# Altium schematic sheet TEAM12_SCHEMATIC.SchDoc
size A3; SheetNumber: 2; SheetTotal: 2
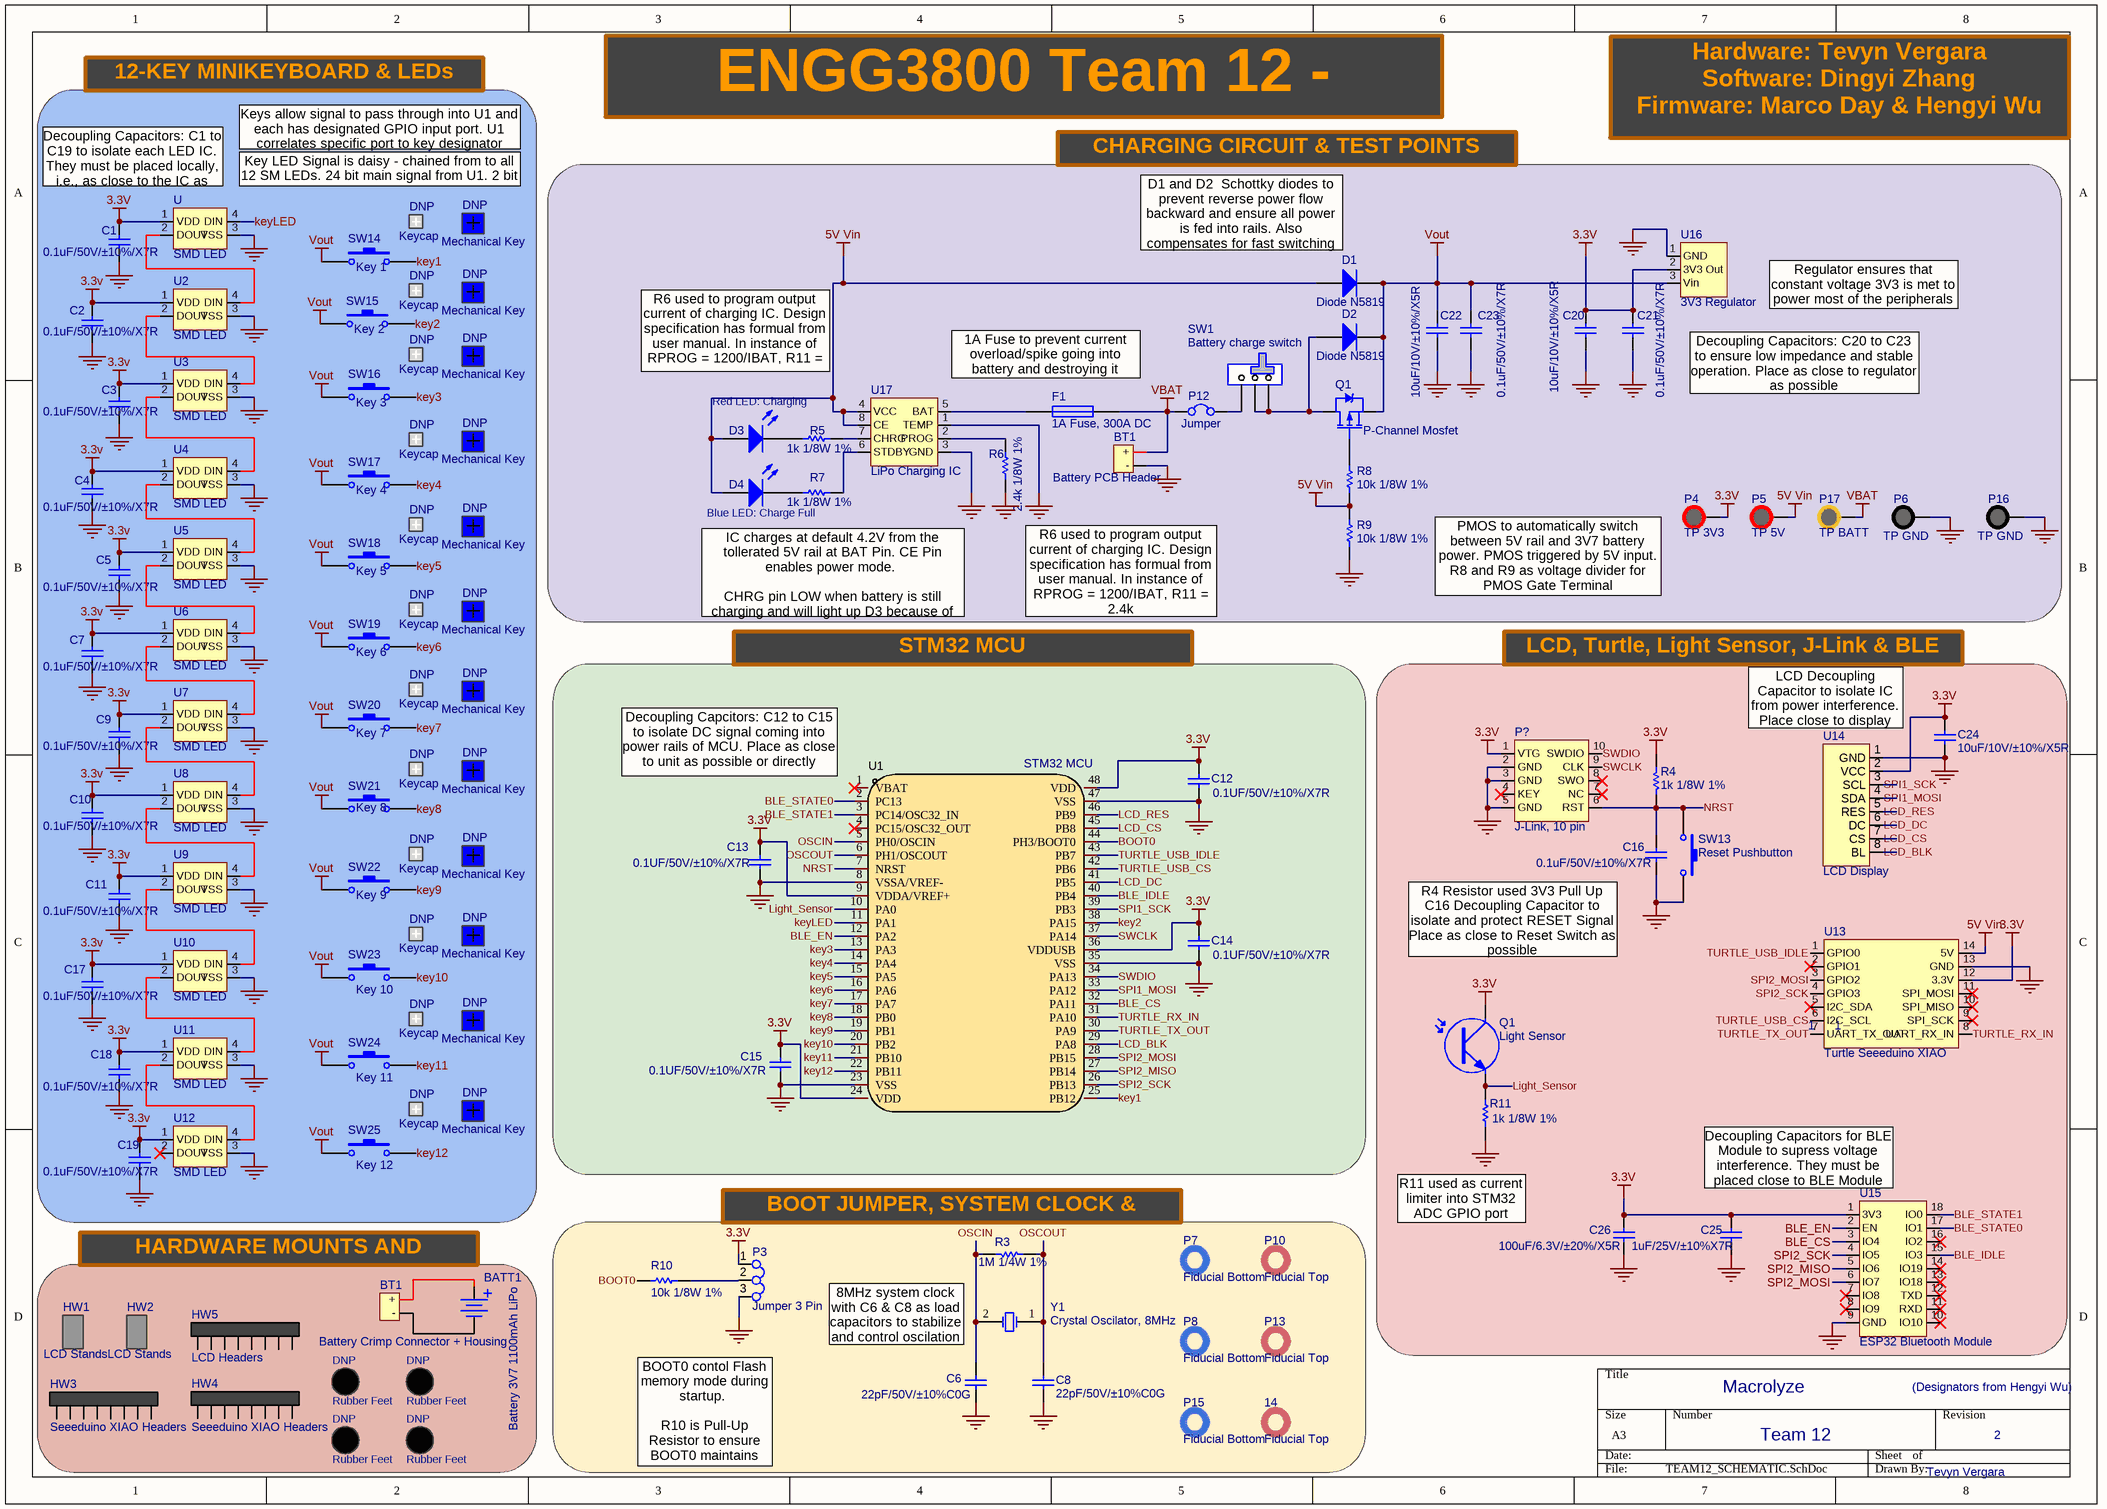
[diagram p0: TEAM12_SCHEMATIC.SchDoc]

## Parts
(Parts that share a designator on the sheet are numbered #1, #2 ... from top to bottom, then left to right.)
14  Fiducial Top
BATT1  Battery 3V7 1100mAh LiPo  [BAT-2]
BT1#1  Battery PCB Header
BT1#2  Battery Crimp Connector + Housing
C1  value 0.1uF/50V/±10%/X7R  [0805]
C2  value 0.1uF/50V/±10%/X7R  [0805]
C3  value 0.1uF/50V/±10%/X7R  [0805]
C4  value 0.1uF/50V/±10%/X7R  [0805]
C5  value 0.1uF/50V/±10%/X7R  [0805]
C6  value 22pF/50V/±10%C0G  [0805]
C7  value 0.1uF/50V/±10%/X7R  [0805]
C8  value 22pF/50V/±10%C0G  [0805]
C9  value 0.1uF/50V/±10%/X7R  [0805]
C10  value 0.1uF/50V/±10%/X7R  [0805]
C11  value 0.1uF/50V/±10%/X7R  [0805]
C12  value 0.1UF/50V/±10%/X7R  [1206C]
C13  value 0.1UF/50V/±10%/X7R  [1206C]
C14  value 0.1UF/50V/±10%/X7R  [1206C]
C15  value 0.1UF/50V/±10%/X7R  [1206C]
C16  value 0.1uF/50V/±10%/X7R  [1206C]
C17  value 0.1uF/50V/±10%/X7R  [0805]
C18  value 0.1uF/50V/±10%/X7R  [0805]
C19  value 0.1uF/50V/±10%/X7R  [0805]
C20  value 10uF/10V/±10%/X5R  [1206C]
C21  value 0.1uF/50V/±10%/X7R  [1206C]
C22  value 10uF/10V/±10%/X5R  [1206C]
C23  value 0.1uF/50V/±10%/X7R  [1206C]
C24  value 10uF/10V/±10%/X5R  [1206C]
C25  value 1uF/25V/±10%X7R  [0805]
C26  value 100uF/6.3V/±20%/X5R  [1206C]
D1  Diode N5819  [DO-41]
D2  Diode N5819  [DO-41]
D3  Red LED: Charging  [0805LED]
D4  Blue LED: Charge Full  [0805LED]
DNP#1  Keycap
DNP#2  Mechanical Key
DNP#3  Keycap
DNP#4  Mechanical Key
DNP#5  Keycap
DNP#6  Mechanical Key
DNP#7  Keycap
DNP#8  Mechanical Key
DNP#9  Keycap
DNP#10  Mechanical Key
DNP#11  Keycap
DNP#12  Mechanical Key
DNP#13  Keycap
DNP#14  Mechanical Key
DNP#15  Keycap
DNP#16  Mechanical Key
DNP#17  Keycap
DNP#18  Mechanical Key
DNP#19  Keycap
DNP#20  Mechanical Key
DNP#21  Keycap
DNP#22  Mechanical Key
DNP#23  Keycap
DNP#24  Mechanical Key
DNP#25  Rubber Feet
DNP#26  Rubber Feet
DNP#27  Rubber Feet
DNP#28  Rubber Feet
F1  1A Fuse, 300A DC  [PIN-W2/E2.8]
HW1  LCD Stands
HW2  LCD Stands
HW3  Seeeduino XIAO Headers
HW4  Seeeduino XIAO Headers
HW5  LCD Headers
P3  Jumper 3 Pin  [HDR1X3]
P4  TP 3V3  [测试点 - duplicate]
P5  TP 5V  [测试点 - duplicate]
P6  TP GND  [mark点]
P7  Fiducial Bottom
P8  Fiducial Bottom
P10  Fiducial Top
P12  Jumper  [HDR1X2]
P13  Fiducial Top
P15  Fiducial Bottom
P16  TP GND  [mark点]
P17  TP BATT  [测试点 - duplicate]
P?  J-Link, 10 pin  [IDC-TH_10P-P1.27]
Q1#1  P-Channel Mosfet  [SOT-23-3_L2.9-W1.4-P1.90-LS2.6-BR]
Q1#2  Light Sensor  [TO-220_A]
R3  value 1M 1/4W 1%  [0805]
R4  value 1k 1/8W 1%  [0805]
R5  value 1k 1/8W 1%  [0805]
R6  value 2.4k 1/8W 1%  [0805]
R7  value 1k 1/8W 1%  [0805]
R8  value 10k 1/8W 1%  [0805]
R9  value 10k 1/8W 1%  [0805]
R10  value 10k 1/8W 1%  [0805]
R11  value 1k 1/8W 1%  [0805]
SW1  Battery charge switch  [sw-pb]
SW13  Reset Pushbutton  [AN6X6]
SW14  Key 1  [SMD_KEYBOARD-SW]
SW15  Key 2  [SMD_KEYBOARD-SW]
SW16  Key 3  [SMD_KEYBOARD-SW]
SW17  Key 4  [SMD_KEYBOARD-SW]
SW18  Key 5  [SMD_KEYBOARD-SW]
SW19  Key 6  [SMD_KEYBOARD-SW]
SW20  Key 7  [SMD_KEYBOARD-SW]
SW21  Key 8  [SMD_KEYBOARD-SW]
SW22  Key 9  [SMD_KEYBOARD-SW]
SW23  Key 10  [SMD_KEYBOARD-SW]
SW24  Key 11  [SMD_KEYBOARD-SW]
SW25  Key 12  [SMD_KEYBOARD-SW]
U  SMD LED
U1  STM32 MCU  [LQFP-48_L7.0-W7.0-P0.50-LS9.0-BL - duplicate]
U2  SMD LED
U3  SMD LED
U4  SMD LED
U5  SMD LED
U6  SMD LED
U7  SMD LED
U8  SMD LED
U9  SMD LED
U10  SMD LED
U11  SMD LED
U12  SMD LED
U13  Turtle Seeeduino XIAO  [HDR-TH_7P-P2.54-V-F]
U14  LCD Display  [HDR1X8]
U15  ESP32 Bluetooth Module  [esp32]
U16  3V3 Regulator  [SOT-223_L6.5-W3.5-P2.30-LS7.0-BR]
U17  LiPo Charging IC  [ESOP-8 4056]
Y1  Crystal Oscilator, 8MHz  [XTAL-A]

## Nets
3.3V: C1.2 C2.2 C3.2 C4.2 C5.2 C7.2 C9.2 C10.2 C11.2 C12.2 C13.2 C14.2 C15.2 C17.1 C18.2 C19.1 C20.2 C21.2 C24.2 C25.2 C26.2 P3.1 P4.1 P?.1(VTG) Q1#2.1(C) R4.2 U.1(VDD) U1.9(VDDA/VREF+) U1.24(VDD) U1.36(VDDUSB) U1.48(VDD) U2.1(VDD) U3.1(VDD) U4.1(VDD) U5.1(VDD) U6.1(VDD) U7.1(VDD) U8.1(VDD) U9.1(VDD) U10.1(VDD) U11.1(VDD) U12.1(VDD) U13.12(3.3V) U14.2(VCC) U15.1(3V3) U16.2(3V3_Out)
5V Vin: D1.1(A) D3.1(A) D4.1(A) P5.1 R8.1 R9.2 U13.14(5V) U17.4(VCC) U17.8(CE)
GND: BT1#1.2(-) C1.1 C2.1 C3.1 C4.1 C5.1 C6.2 C7.1 C8.2 C9.1 C10.1 C11.1 C12.1 C13.1 C14.1 C15.1 C16.1 C17.2 C18.1 C19.2 C20.1 C21.1 C22.1 C23.1 C24.1 C25.1 C26.1 P3.3 P6.1 P16.1 P?.2(GND) P?.3(GND) P?.5(GND) R6.2 R9.1 R11.1 SW13.1 U.3(VSS) U1.8(VSSA/VREF-) U1.23(VSS) U1.35(VSS) U1.47(VSS) U2.3(VSS) U3.3(VSS) U4.3(VSS) U5.3(VSS) U6.3(VSS) U7.3(VSS) U8.3(VSS) U9.3(VSS) U10.3(VSS) U11.3(VSS) U12.3(VSS) U13.13(GND) U14.1(GND) U15.9(GND) U16.1(GND) U17.1(TEMP) U17.3(GND)
VBAT: BT1#1.1(+) F1.2 P12.1 P17.1
Vout: C22.2 C23.2 D1.2(K) D2.2(K) Q1#1.3(S) SW14.1 SW15.1 SW16.1 SW17.1 SW18.1 SW19.1 SW20.1 SW21.1 SW22.1 SW23.1 SW24.1 SW25.1 U16.3(Vin)
BLE_CS: U1.32(PA11) U15.3(IO4)
BLE_EN: U1.12(PA2) U15.2(EN)
BLE_IDLE: U1.40(PB4) U15.15(IO3)
BLE_STATE0: U1.2(PC13) U15.17(IO1)
BLE_STATE1: U1.3(PC14/OSC32_IN) U15.18(IO0)
BOOT0: R10.2 U1.44(PH3/BOOT0)
key1: SW14.2 U1.25(PB12)
key2: SW15.2 U1.38(PA15)
key3: SW16.2 U1.13(PA3)
key4: SW17.2 U1.14(PA4)
key5: SW18.2 U1.15(PA5)
key6: SW19.2 U1.16(PA6)
key7: SW20.2 U1.17(PA7)
key8: SW21.2 U1.18(PB0)
key9: SW22.2 U1.19(PB1)
key10: SW23.2 U1.20(PB2)
key11: SW24.2 U1.21(PB10)
key12: SW25.2 U1.22(PB11)
keyLED: U.4(DIN) U1.11(PA1)
LCD_BLK: U1.29(PA8) U14.8(BL)
LCD_CS: U1.45(PB8) U14.7(CS)
LCD_DC: U1.41(PB5) U14.6(DC)
LCD_RES: U1.46(PB9) U14.5(RES)
Light_Sensor: Q1#2.3(E) R11.2 U1.10(PA0)
NRST: C16.2 P?.6(RST) R4.1 SW13.2 U1.7(NRST)
OSCIN: C6.1 R3.2 U1.5(PH0/OSCIN) Y1.2(OSC2)
OSCOUT: C8.1 R3.1 U1.6(PH1/OSCOUT) Y1.1(OSC1)
SPI1_MOSI: U1.33(PA12) U14.4(SDA)
SPI1_SCK: U1.39(PB3) U14.3(SCL)
SPI2_MISO: U1.27(PB14) U15.5(IO6)
SPI2_MOSI: U1.28(PB15) U13.3(GPIO2) U15.6(IO7)
SPI2_SCK: U1.26(PB13) U13.4(GPIO3) U15.4(IO5)
SWCLK: P?.9(CLK) U1.37(PA14)
SWDIO: P?.10(SWDIO) U1.34(PA13)
TURTLE_RX_IN: U1.31(PA10) U13.8(UART_RX_IN)
TURTLE_TX_OUT: U1.30(PA9) U13.7(UART_TX_OUT)
TURTLE_USB_CS: U1.42(PB6) U13.6(I2C_SCL)
TURTLE_USB_IDLE: U1.43(PB7) U13.1(GPIO0)
NetBATT1_1: BATT1.1(+) BT1#2.1(+)
NetBATT1_2: BATT1.2(-) BT1#2.2(-)
NetD2_1: D2.1(A) Q1#1.2(D) SW1.1 SW1.3
NetD3_2: D3.2(K) R5.1
NetD4_2: D4.2(K) R7.1
NetF1_1: F1.1 U17.5(BAT)
NetP3_2: P3.2 R10.1
NetP12_2: P12.2 SW1.2
NetQ1#1_1: Q1#1.1(G) R8.2
NetR5_2: R5.2 U17.7(CHRG)
NetR6_1: R6.1 U17.2(PROG)
NetR7_2: R7.2 U17.6(STDBY)
NetU2_2: U2.2(DOUT) U3.4(DIN)
NetU3_2: U3.2(DOUT) U4.4(DIN)
NetU4_2: U4.2(DOUT) U5.4(DIN)
NetU5_2: U5.2(DOUT) U6.4(DIN)
NetU6_2: U6.2(DOUT) U7.4(DIN)
NetU7_2: U7.2(DOUT) U8.4(DIN)
NetU8_2: U8.2(DOUT) U9.4(DIN)
NetU9_2: U9.2(DOUT) U10.4(DIN)
NetU10_2: U10.2(DOUT) U11.4(DIN)
NetU11_2: U11.2(DOUT) U12.4(DIN)
NetU_2: U.2(DOUT) U2.4(DIN)

Not connected (* = marked no-connect by the designer): HW3 7 8 9 10 11 12 13 14; HW4 7 8 9 10 11 12 13 14; HW5 7 8 9 10 11 12 13 14; P? 4(KEY)* 7(NC)* 8(SWO)*; U1 1(VBAT)* 4(PC15/OSC32_OUT)*; U12 2(DOUT)*; U13 2(GPIO1)* 5(I2C_SDA)* 9(SPI_SCK)* 10(SPI_MISO)* 11(SPI_MOSI)*; U15 7(IO8)* 8(IO9)* 10(IO10)* 11(RXD)* 12(TXD)* 13(IO18)* 14(IO19)* 16(IO2)*

## Notes on the sheet
- 12-KEY MINIKEYBOARD & LEDs
- ENGG3800 Team 12 - Macrolyze
- Decoupling Capacitors: C1 to C19 to isolate each LED IC. They must be placed locally, i.e., as close to the IC as possible.
- Key LED Signal is daisy - chained from to all 12 SM LEDs. 24 bit main signal from U1. 2 bit per LED
- Keys allow signal to pass through into U1 and each has designated GPIO input port. U1 correlates specific port to key designator
- CHARGING CIRCUIT & TEST POINTS
- Hardware: Tevyn Vergara
  Software: Dingyi Zhang
  Firmware: Marco Day & Hengyi Wu
- (near D1) D1 and D2  Schottky diodes to prevent reverse power flow backward and ensure all power is fed into rails. Also compensates for fast switching speed of PMOS
- Regulator ensures that constant voltage 3V3 is met to power most of the peripherals and MCU
- R6 used to program output current of charging IC. Design specification has formual from user manual. In instance of RPROG = 1200/IBAT, R11 = 2.4k
- 1A Fuse to prevent current overload/spike going into battery and destroying it
- Decoupling Capacitors: C20 to C23 to ensure low impedance and stable operation. Place as close to regulator as possible
- IC charges at default 4.2V from the tollerated 5V rail at BAT Pin. CE Pin enables power mode.
  CHRG pin LOW when battery is still charging and will light up D3 because of foward voltage. HIGH when Battery is charged and D3 will turn off
  STDBY LED turns on Battery is fully charged as pin goes LOW
- (near P4) PMOS to automatically switch between 5V rail and 3V7 battery power. PMOS triggered by 5V input.
  R8 and R9 as voltage divider for PMOS Gate Terminal
- STM32 MCU
- LCD, Turtle, Light Sensor, J-Link & BLE
- (near U1) Decoupling Capcitors: C12 to C15 to isolate DC signal coming into power rails of MCU. Place as close to unit as possible or directly underneath
- LCD Decoupling Capacitor to isolate IC from power interference. Place close to display
- R4 Resistor used 3V3 Pull Up
  C16 Decoupling Capacitor to isolate and protect RESET Signal
  Place as close to Reset Switch as possible
- (near U13) 1
- Decoupling Capacitors for BLE Module to supress voltage interference. They must be placed close to BLE Module
- HARDWARE MOUNTS AND CONNECTORS
- BOOT JUMPER, SYSTEM CLOCK & FIDUCIALS
- (near R11) R11 used as current limiter into STM32 ADC GPIO port
- 8MHz system clock with C6 & C8 as load capacitors to stabilize and control oscilation frequency
- Macrolyze
- (Designators from Hengyi Wu)
- BOOT0 contol Flash memory mode during startup.
  R10 is Pull-Up Resistor to ensure BOOT0 maintains defined state
- Team 12
- 2
- Tevyn Vergara

## Library data of the parts
14 P10 P13 = Fiducial Top: Top Paste marker
BATT1 = Battery: Multicell Battery; Published: 24-Mar-1999; LatestRevisionDate: 17-Jul-2002; LatestRevisionNote: Re-released for DXP Platform.; PackageReference: BAT-2; Publisher: Altium Limited; PackageDescription: Battery; 2 Leads
BT1#1 BT1#2 = Battery Connector: CONNECTOR : JST PH - Top Entry Header / Surface Mount / 02 Way / 2.00mm Pitch
C1-C26 = Cap: Capacitor; Published: 8-Jun-2000; LatestRevisionDate: 17-Jul-2002; LatestRevisionNote: Re-released for DXP Platform.; PackageReference: RAD-0.3; Publisher: Altium Limited; PackageDescription: Radial Cap, Thru-Hole; 2 Leads; 0.3 in Pin Spacing
D1 D2 = Diode 1N4934: 1 Amp Fast Recovery Rectifier; Published: 8-Jun-2000; LatestRevisionDate: 17-Jul-2002; LatestRevisionNote: Re-released for DXP Platform.; DatasheetVersion: 1999; PackageVersion: Aug-1999; PackageReference: DO-41; Publisher: Altium Limited; PackageDescription: Diode, Axial; Body 5.2 x 2.7 mm (LxDia. max), Lead Dia. 0.86 mm (max); Code_JEDEC: DO-204-AL; ComponentLink1Description: Manufacturer Link; ComponentLink1URL: http://www.fairchildsemi.com/; ComponentLink2Description: Datasheet; ComponentLink2URL: http://www.fairchildsemi.com/ds/1N%2F1N4934.pdf
D3 = LED0: Typical INFRARED GaAs LED / MCL-S270SRC; Published: 8-Jun-2000; LatestRevisionDate: 08-Jul-2005; LatestRevisionNote: Mech Layer 1 removed.; PackageReference: LED-0; Publisher: Altium Limited; PackageDescription: LED; 2 Leads
D4 = LED0: Typical INFRARED GaAs LED; Published: 8-Jun-2000; LatestRevisionDate: 08-Jul-2005; LatestRevisionNote: Mech Layer 1 removed.; PackageReference: LED-0; Publisher: Altium Limited; PackageDescription: LED; 2 Leads
DNP#1 DNP#3 DNP#5 DNP#7 DNP#9 DNP#11 DNP#13 DNP#15 DNP#17 DNP#19 DNP#21 DNP#23 = CEO8137: Keycaps for Kailh Mechanical Keyboard Switches
DNP#2 DNP#4 DNP#6 DNP#8 DNP#10 DNP#12 DNP#14 DNP#16 DNP#18 DNP#20 DNP#22 DNP#24 = ADA4955: Kailh Mechanical Key Switches
DNP#25-DNP#28 = SJ5003: 3M Hemispherical PUR/ Self Adhesive Feet / 11.2mm diameter x 5mm height
F1 = Fuse 1: FUSES : Axial Lead / Quick Blow (F) / Ceramic / Standard / 01.000A / 1A / 125VAC / 0251001.MRT1L; Published: 8-Jun-2000; LatestRevisionDate: 17-Jul-2002; LatestRevisionNote: Re-released for DXP Platform.; PackageReference: PIN-W2/E2.8; Publisher: Altium Limited; PackageDescription: Thru-Hole; 2 Leads
HW1 HW2 = LCD Stands: FASTENER : Spacer / Female - Female / Nylon / Hexagonal / M3 x 12
HW3-HW5 = S2B-PH-K-S: CONNECTOR : PCB HDR - Single Row Header / Female / Straight / 1 x 08 / Gold Plated
P3 = Jumper 3 Pin: Header, 3-Pin; LatestRevisionDate: 17-Jul-2002; LatestRevisionNote: Re-released for DXP Platform.; Publisher: Altium Limited
P4 = Test Point 3V3: 3V3 Test Point
P5 = Test Point 5V: 5V Test Point
P6 P16 = Test Point GND: GND Test Point
P7 P8 P15 = Fiducial Bottom: Bottom Paste marker
P12 = Jumper: Power Jumper, 2 Pin; LatestRevisionDate: 17-Jul-2002; LatestRevisionNote: Re-released for DXP Platform.; Publisher: Altium Limited
P17 = Test Point Battery: 3V7, 1100mAh Battery Test Point
P? = J-Link Connector: J-Link, 10 pin, dual row; LatestRevisionDate: 17-Jul-2002; LatestRevisionNote: Re-released for DXP Platform.; Publisher: Altium Limited
Q1#1 = PMOS-2: MOSFET P-CH 100V 23A TO220AB / IRF9540NPBF; Note: Pin 4 not drawn and electrically connected to Pin 2.; Published: 8-Jun-2000; LatestRevisionDate: 17-Jul-2002; LatestRevisionNote: Re-released for DXP Platform.; DatasheetVersion: PD-9.390D; PackageVersion: Feb-1997; PackageReference: TO-220AB; Publisher: Altium Limited; PackageDescription: TO, Thru-Hole, Vertical, Heatsink Mounted; 3 In-Line Leads; Pitch 2.54 mm; ComponentLink1Description: Manufacturer Link; ComponentLink1URL: http://www.irf.com/
Q1#2 = Photo NPN: SENSOR PHOTO 860NM TOP VIEW RAD NPN / SFH 309-4/5; Published: 24-Mar-1999; LatestRevisionDate: 17-Jul-2002; LatestRevisionNote: Re-released for DXP Platform.; PackageReference: TO-220_A; Publisher: Altium Limited; Code_JEDEC: TO-220-AC
R3-R11 = Res1: Resistor; Published: 8-Jun-2000; LatestRevisionDate: 17-Jul-2002; LatestRevisionNote: Re-released for DXP Platform.; PackageReference: AXIAL-0.3; Publisher: Altium Limited; PackageDescription: Axial Device, Thru-Hole; 2 Leads; 0.3 in Pin Spacing
SW1 = 09.030201.02: SWITCH : PCB Mount / Slide / Min / SPDT = (on) < w > (off)
SW13-SW25 = SW-PB: Switch; Published: 24-Mar-1999; LatestRevisionDate: 17-Jul-2002; LatestRevisionNote: Re-released for DXP Platform.; PackageReference: SPST-2; Publisher: Altium Limited; PackageDescription: Switch; 2 Leads
U U2-U12 = SK6812MINI-E: 3.2x2.8x1.78 mm 0.2W Intelligent external control surface mount SMD LED
U1 = STM32L433CCU6: Microcontroller - STM32L433CCU6; Manufacturer: ST(意法半导体); Add into BOM: yes; CPU Core: ARM Cortex-M4; CPU Maximum Speed: 80MHz; Operating Voltage Range: 1.71V~3.6V; Program Storage Size: 256KB; Program Memory Type: FLASH; RAM Size: 64KB; GPIO Ports Number: 38; ADC (Bit): 12bit; Universal Serial Bus: 有; Peripheral/Function: DMA；LCD/LED驱动；看门狗；看门狗; Name: STM32L433CCU6; Symbol: STM32L433CCU6; Device: STM32L433CCU6; LCSC Part Name: ARM Cortex-M4 80MHz; Supplier Part: C1341450; Manufacturer Part: STM32L433CCU6; Supplier Footprint: UFQFPN-48(7x7); JLCPCB Part Class: Extended Part; Datasheet: https://atta.szlcsc.com/upload/public/pdf/source/20210707/C1337509_BD7F9EDC19894909F82F16C45C18A206.pdf; Supplier: LCSC; Convert to PCB: yes; EEPROM: -; DAC (Bit): 12bit; PWM (Bit): -; Internal Comparator: -; communication protocol: -; Watchdog: 有; Real-Time Clock: -; Infrared Data Association: 有; Low-Voltage Detect: -; CCP Capture/Compare: -; LCD Module: 有; Secure Digital Input and Output: -; Direct Memory Access: 有; Internal Oscillator: 有; Operating Temperature Range: -40℃~+85℃
U13 = 102010328: Seeeduino XIAO - Arduino Microcontroller - SAMD21 Cortex M0+
U14 = ER-TFTM0.96A1-1: LCD Display / 0.96" SPI 160 x 80 TFT / VDD 3.3V
U15 = ESP32-C3-WROOM-02-N4: Wifi / Bluetooth Module / ESP32-C3-WROOM-02-H4 / Multiprotocol Modules SMD module, ESP32-C3, 4MB SPI flash, PCB antenna, -40 C +105 C
U16 = MCP1700-3302E/TO: IC REG LINEAR 3.3V 250MA TO92-3
U17 = BQ2057CDGKR: IC BATT CHG LI-ION 1CELL 8VSSOP
Y1 = LFXTAL003151Cutt: TIMING FUNCTIONS : Crystal / 8MHz / HC49/4HSMX Packag; Published: 8-Jun-2000; LatestRevisionDate: 17-Jul-2002; LatestRevisionNote: Re-released for DXP Platform.; PackageReference: R38; Publisher: Altium Limited; PackageDescription: Crystal, Thru-Hole; 2 Leads; Body 3.1 x 8.2 mm (Dia.xH)